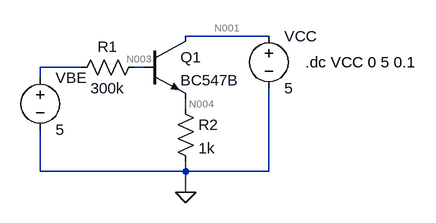
[diagram p0: schematic Draft1.asc]
Draft1.asc, the LTspice schematic file:
Version 4.1
SHEET 1 880 680
WIRE 352 112 224 112
WIRE 64 160 0 160
WIRE 160 160 144 160
WIRE 0 176 0 160
WIRE 224 224 224 208
WIRE 0 320 0 256
WIRE 224 320 224 304
WIRE 224 320 0 320
WIRE 352 320 352 192
WIRE 352 320 224 320
WIRE 224 352 224 320
FLAG 224 352 0
SYMBOL npn 160 112 R0
SYMATTR InstName Q1
SYMATTR Value BC547B
SYMBOL voltage 352 96 R0
SYMATTR InstName VCC
SYMATTR Value 5
SYMBOL voltage 0 160 R0
SYMATTR InstName VBE
SYMATTR Value 5
SYMBOL res 160 144 R90
WINDOW 0 0 56 VBottom 2
WINDOW 3 32 56 VTop 2
SYMATTR InstName R1
SYMATTR Value 300k
SYMBOL res 208 208 R0
SYMATTR InstName R2
SYMATTR Value 1k
TEXT 408 152 Left 2 !.dc VCC 0 5 0.1

The netlist it stands for:
* Draft1.asc
Q1 N001 N003 N004 0 BC547B
VCC N001 0 5
VBE N002 0 5
R1 N003 N002 300k
R2 N004 0 1k
.model NPN NPN
.model PNP PNP
.lib standard.bjt
.dc VCC 0 5 0.1
.backanno
.end

* Results of the author's LTspice run, read from the files saved beside the schematic
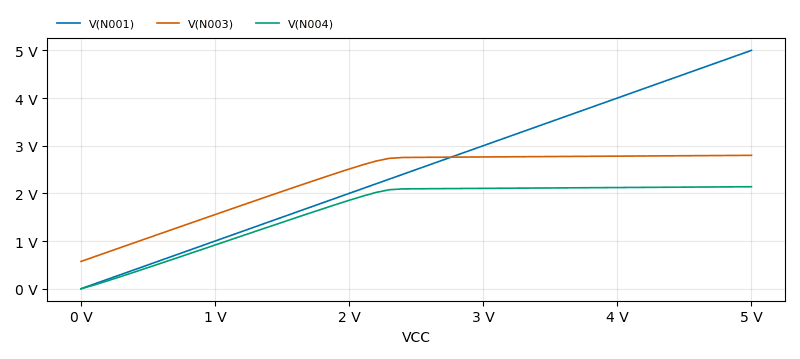
[diagram p1: DC transfer characteristic of Draft1.asc, plotted from the saved traces]
* DC transfer characteristic, 1 run:
*   V(N001): 0 V at VCC=0 V, 5 V at VCC=5 V, min 0 V, max 5 V
*   V(N003): 572.1 mV at VCC=0 V, 2.798 V at VCC=5 V, min 572.1 mV, max 2.798 V
*   V(N004): -1.659 mV at VCC=0 V, 2.139 V at VCC=5 V, min -1.659 mV, max 2.139 V